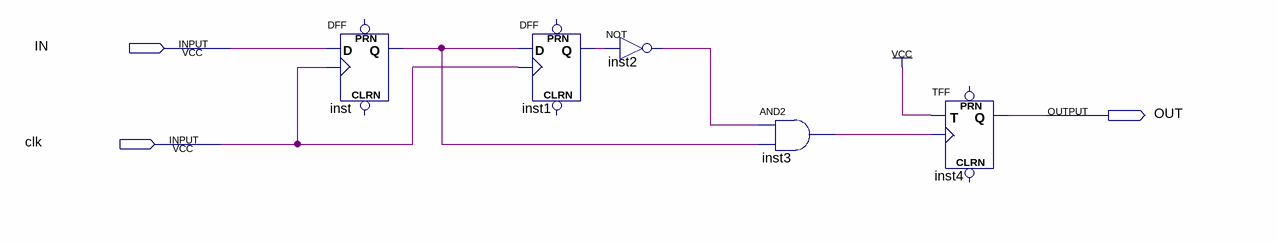
[diagram p0: schematic sheet]
// Quartus schematic deb2.bdf as structural Verilog: 5 symbols, 3 pins
module deb2 (
  input  IN,
  input  clk,
  output OUT
);

  wire inst1_q, inst2_out, inst3_out, inst_q;

  DFF inst (.CLK(clk), .D(IN), .Q(inst_q));  // open: CLRN, PRN
  DFF inst1 (.CLK(clk), .D(inst_q), .Q(inst1_q));  // open: CLRN, PRN
  not inst2 (inst2_out, inst1_q);
  and inst3 (inst3_out, inst2_out, inst_q);
  TFF inst4 (.T(1'b1), .CLK(inst3_out), .Q(OUT));  // open: PRN, CLRN
endmodule
